# EAGLE design b10n1c (EAGLE 6.4)
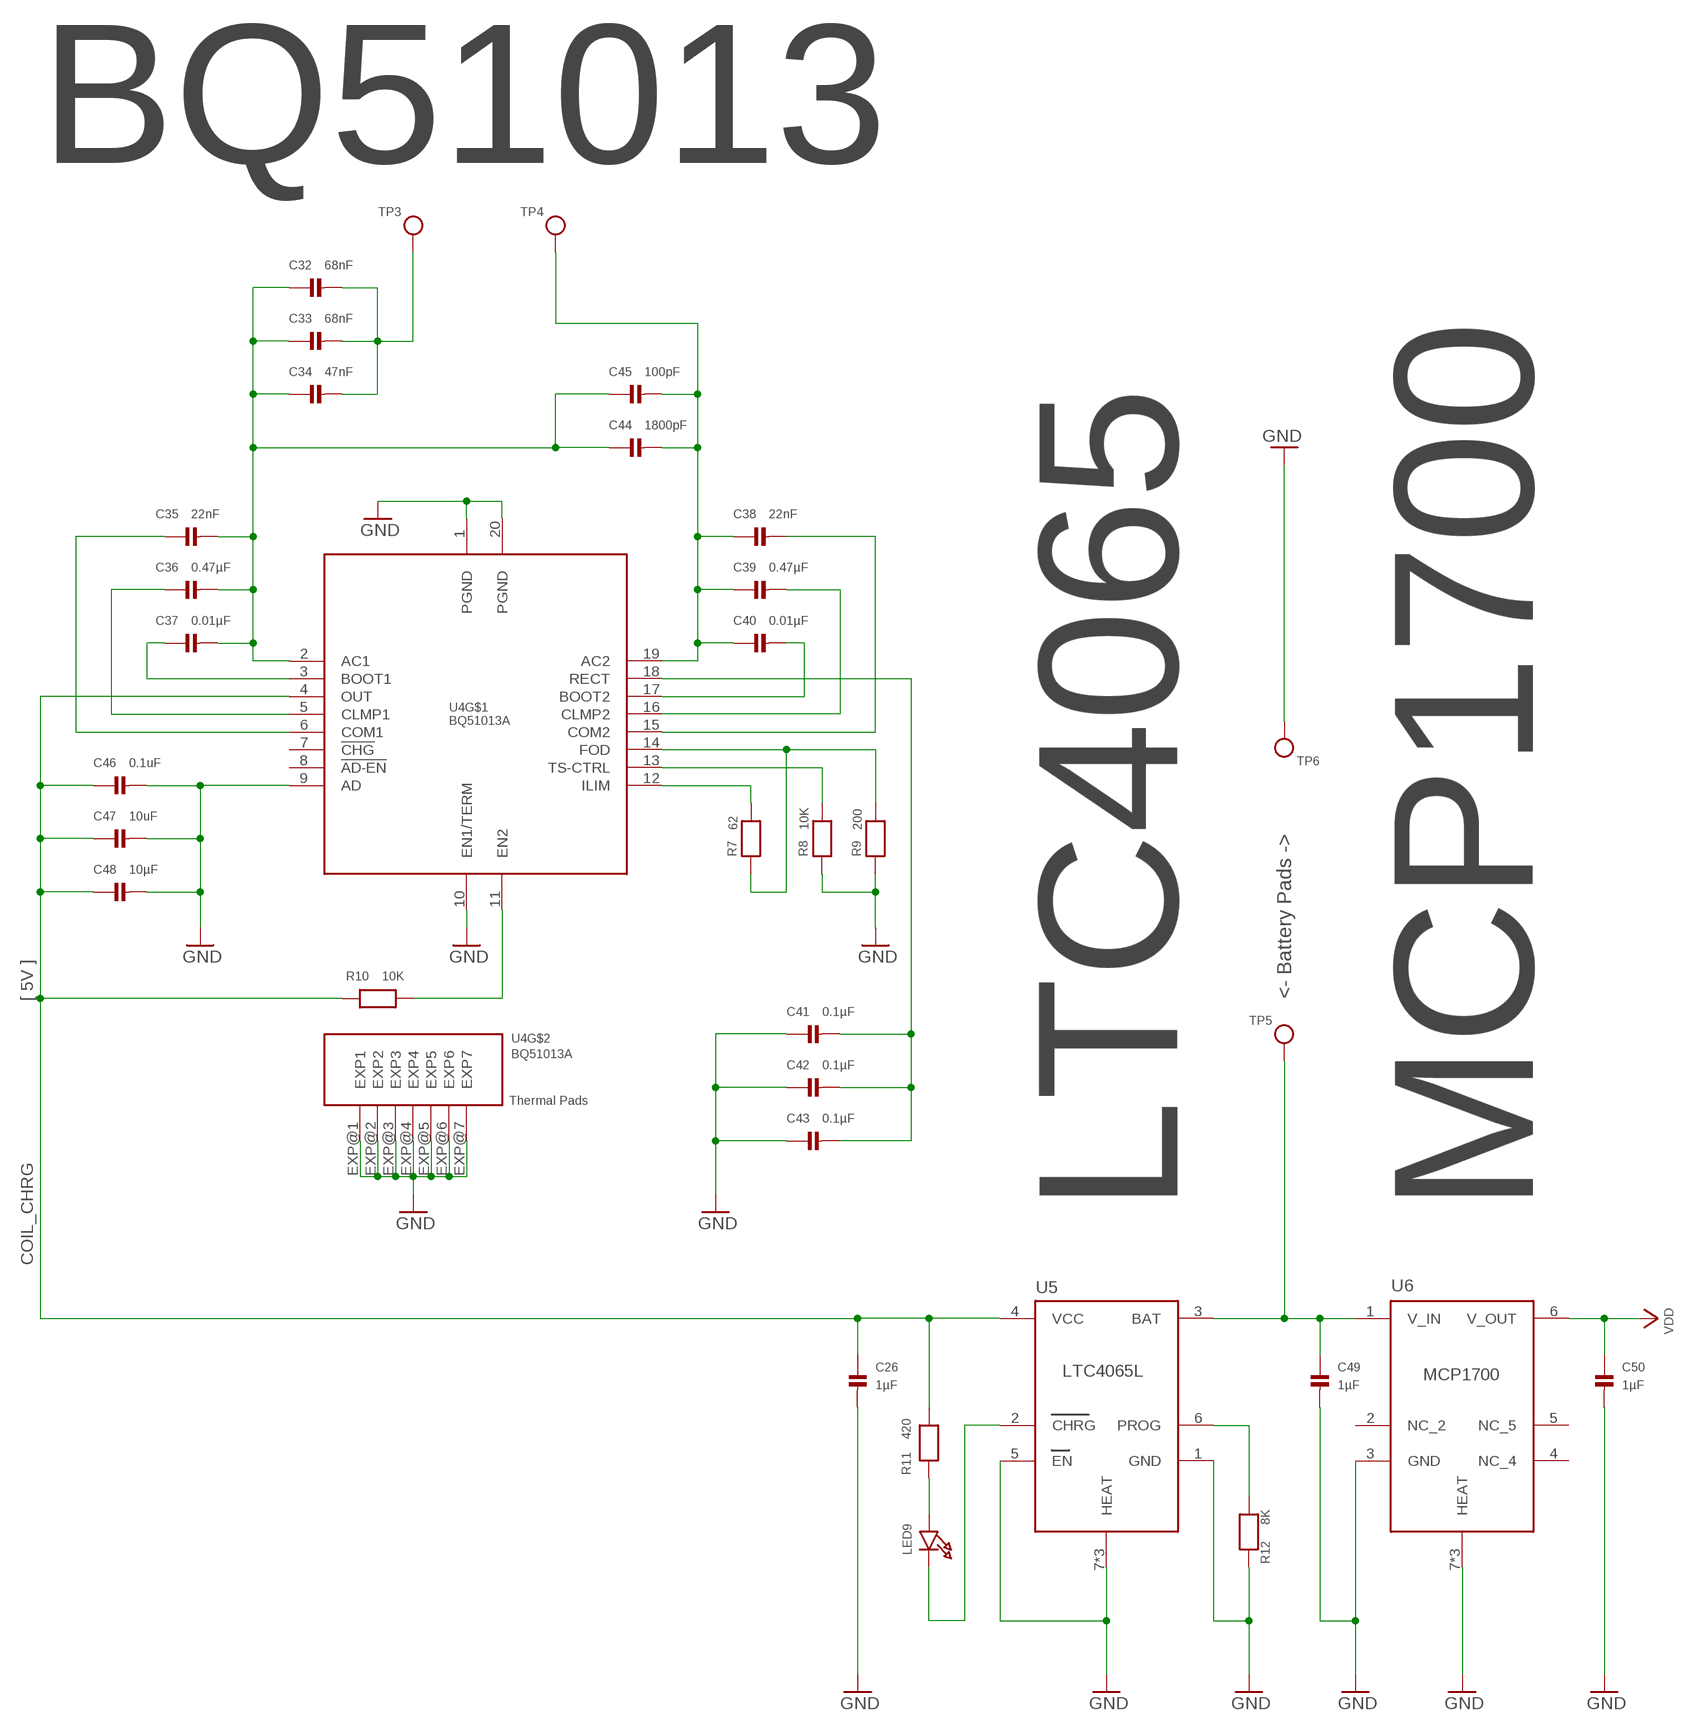
[diagram p0: schematic, sheet 1, part 1 of 2]
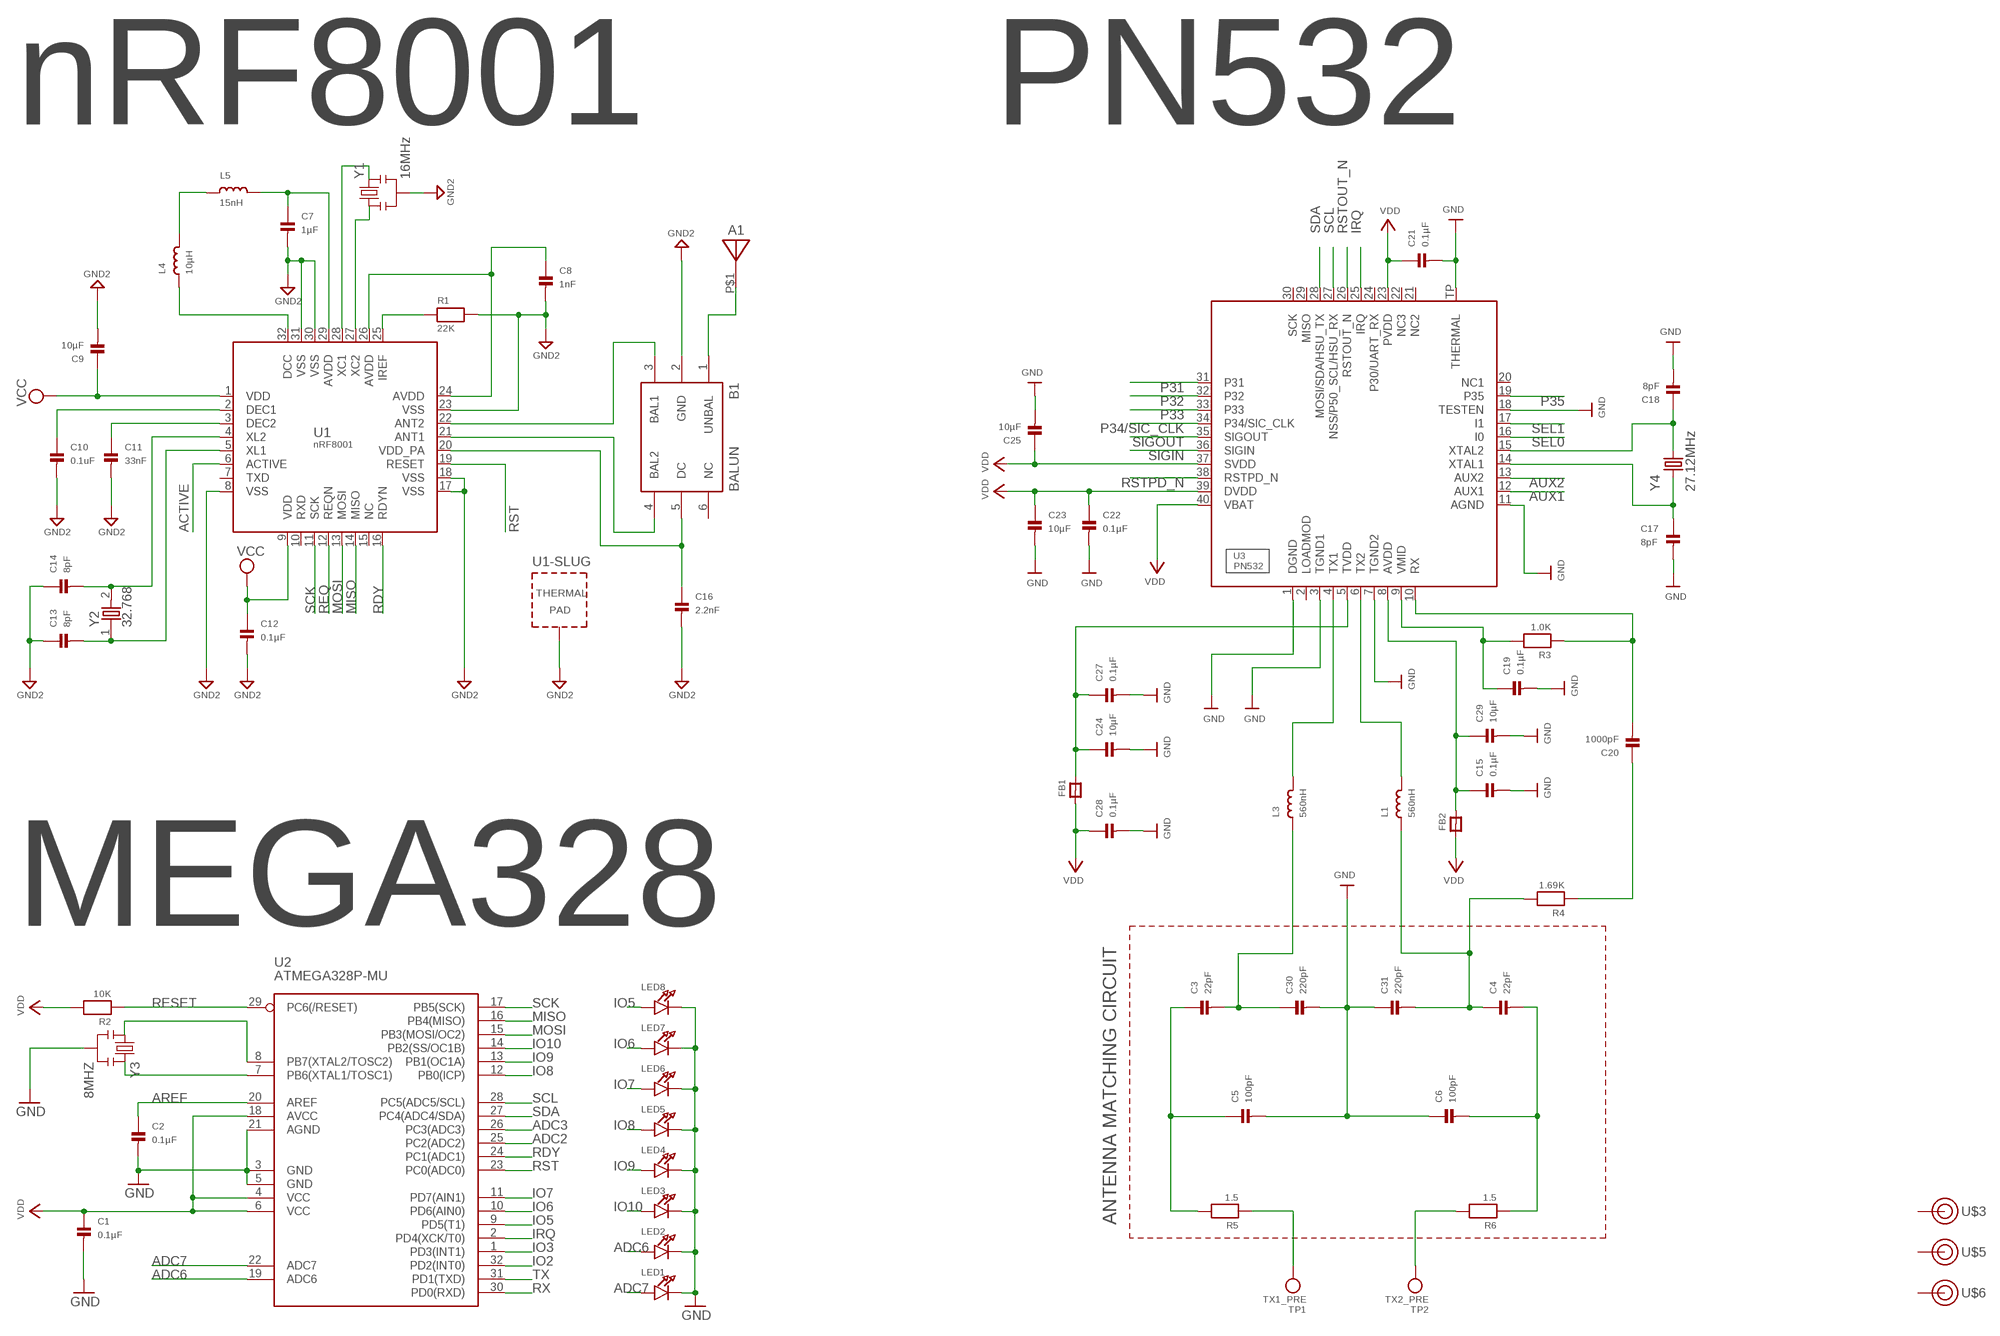
[diagram p1: schematic, sheet 1, part 2 of 2]

## Parts
A1  2450AT18A100  [2450AT18A100]
B1  2450BM14A0002T  [2450BM14A0002T]
C1  0.1µF  CAP_CERAMIC_0402MP  [_0402MP]
C2  0.1µF  CAP_CERAMIC_0402MP  [_0402MP]
C3  22pF  CAP_CERAMIC_0402MP  [_0402MP]
C4  22pF  CAP_CERAMIC_0402MP  [_0402MP]
C5  100pF  CAP_CERAMIC_0402MP  [_0402MP]
C6  100pF  CAP_CERAMIC_0402MP  [_0402MP]
C7  1µF  CAP_CERAMIC_0402MP  [_0402MP]
C8  1nF  CAP_CERAMIC_0402MP  [_0402MP]
C9  10µF  CAP_CERAMIC_0402MP  [_0402MP]
C10  0.1uF  CAP_CERAMIC_0402MP  [_0402MP]
C11  33nF  CAP_CERAMIC_0402MP  [_0402MP]
C12  0.1µF  CAP_CERAMIC_0402MP  [_0402MP]
C13  8pF  CAP_CERAMIC_0402MP  [_0402MP]
C14  8pF  CAP_CERAMIC_0402MP  [_0402MP]
C15  0.1µF  CAP_CERAMIC_0402MP  [_0402MP]
C16  2.2nF  CAP_CERAMIC_0402MP  [_0402MP]
C17  8pF  CAP_CERAMIC_0402MP  [_0402MP]
C18  8pF  CAP_CERAMIC_0402MP  [_0402MP]
C19  0.1µF  CAP_CERAMIC_0402MP  [_0402MP]
C20  1000pF  CAP_CERAMIC_0402MP  [_0402MP]
C21  0.1µF  CAP_CERAMIC_0402MP  [_0402MP]
C22  0.1µF  CAP_CERAMIC_0402MP  [_0402MP]
C23  10µF  CAP_CERAMIC_0402MP  [_0402MP]
C24  10µF  CAP_CERAMIC_0402MP  [_0402MP]
C25  10µF  CAP_CERAMIC_0402MP  [_0402MP]
C26  1µF  CAP_CERAMIC_0402MP  [_0402MP]
C27  0.1µF  CAP_CERAMIC_0402MP  [_0402MP]
C28  0.1µF  CAP_CERAMIC_0402MP  [_0402MP]
C29  10µF  CAP_CERAMIC_0402MP  [_0402MP]
C30  220pF  CAP_CERAMIC_0402MP  [_0402MP]
C31  220pF  CAP_CERAMIC_0402MP  [_0402MP]
C32  68nF  CAP_CERAMIC_0402MP  [_0402MP]
C33  68nF  CAP_CERAMIC_0402MP  [_0402MP]
C34  47nF  CAP_CERAMIC_0402MP  [_0402MP]
C35  22nF  CAP_CERAMIC_0402MP  [_0402MP]
C36  0.47µF  CAP_CERAMIC_0402MP  [_0402MP]
C37  0.01µF  CAP_CERAMIC_0402MP  [_0402MP]
C38  22nF  CAP_CERAMIC_0402MP  [_0402MP]
C39  0.47µF  CAP_CERAMIC_0402MP  [_0402MP]
C40  0.01µF  CAP_CERAMIC_0402MP  [_0402MP]
C41  0.1µF  CAP_CERAMIC_0402MP  [_0402MP]
C42  0.1µF  CAP_CERAMIC_0402MP  [_0402MP]
C43  0.1µF  CAP_CERAMIC_0402MP  [_0402MP]
C44  1800pF  CAP_CERAMIC_0402MP  [_0402MP]
C45  100pF  CAP_CERAMIC_0402MP  [_0402MP]
C46  0.1uF  CAP_CERAMIC_0402MP  [_0402MP]
C47  10uF  CAP_CERAMIC_0402MP  [_0402MP]
C48  10µF  CAP_CERAMIC_0402MP  [_0402MP]
C49  1µF  CAP_CERAMIC_0402MP  [_0402MP]
C50  1µF  CAP_CERAMIC_0402MP  [_0402MP]
FB1  FERRITE_0402MP  [_0402MP]
FB2  FERRITE_0402MP  [_0402MP]
L1  560nH  INDUCTOR_0402MP  [_0402MP]
L3  560nH  INDUCTOR_0402MP  [_0402MP]
L4  10µH  INDUCTOR_0603MP  [_0603MP]
L5  15nH  INDUCTOR_0402MP  [_0402MP]
LED1  LED0603_NOOUTLINE  [CHIPLED_0603_NOOUTLINE]
LED2  LED0603_NOOUTLINE  [CHIPLED_0603_NOOUTLINE]
LED3  LED0603_NOOUTLINE  [CHIPLED_0603_NOOUTLINE]
LED4  LED0603_NOOUTLINE  [CHIPLED_0603_NOOUTLINE]
LED5  LED0603_NOOUTLINE  [CHIPLED_0603_NOOUTLINE]
LED6  LED0603_NOOUTLINE  [CHIPLED_0603_NOOUTLINE]
LED7  LED0603_NOOUTLINE  [CHIPLED_0603_NOOUTLINE]
LED8  LED0603_NOOUTLINE  [CHIPLED_0603_NOOUTLINE]
LED9  LED0603_NOOUTLINE  [CHIPLED_0603_NOOUTLINE]
R1  22K  RESISTOR_0402MP  [_0402MP]
R2  10K  RESISTOR_0402MP  [_0402MP]
R3  1.0K  RESISTOR_0402MP  [_0402MP]
R4  1.69K  RESISTOR_0402MP  [_0402MP]
R5  1.5  RESISTOR_0402MP  [_0402MP]
R6  1.5  RESISTOR_0402MP  [_0402MP]
R7  62  RESISTOR_0402MP  [_0402MP]
R8  10K  RESISTOR_0402MP  [_0402MP]
R9  200  RESISTOR_0402MP  [_0402MP]
R10  10K  RESISTOR_0402MP  [_0402MP]
R11  420  RESISTOR_0402MP  [_0402MP]
R12  8K  RESISTOR_0402MP  [_0402MP]
TP1  TX1_PRE  TESTPOINTROUND1MM  [TESTPOINT_ROUND_1MM]
TP2  TX2_PRE  TESTPOINTROUND1MM  [TESTPOINT_ROUND_1MM]
TP3  TESTPOINTROUND1MM  [TESTPOINT_ROUND_1MM]
TP4  TESTPOINTROUND1MM  [TESTPOINT_ROUND_1MM]
TP5  TESTPOINTROUND1MM  [TESTPOINT_ROUND_1MM]
TP6  TESTPOINTROUND1MM  [TESTPOINT_ROUND_1MM]
U1  nRF8001  NRF8001  [QFN32_5MM]
U2  ATMEGA328P-MU  ATMEGAXX8-MU  [MLF32-M1-A]
U3  PN532  [HVQFN40-6X6]
U4  BQ51013A  [RHL_R-VQFN-N20]
U5  LTC4065L  [LTC4065L]
U6  MCP1700  [MCP1700]
U$3  MAKE-UB312-MICRO  [MAKE-UB312-MICRO]
U$5  MAKE-UB312-MICRO  [MAKE-UB312-MICRO]
U$6  MAKE-UB312-MICRO  [MAKE-UB312-MICRO]
Y1  16MHz  RESONATOR16MHZ  [RESONATOR-SMD]
Y2  32.768  CRYSTAL2PIN  [CRYSTAL-2PIN]
Y3  8MHZ  RESONATOR8MHZ  [RESONATOR-SMD]
Y4  27.12MHz  CRYSTAL  [CRYSTAL-MURATA-XRCGB27M120F3M00R0]

## Nets
AC: B1.2(GND) C7.2 C8.2 C9.2 C10.2 C11.2 C12.2 C13.1 C14.1 C16.2 R1.2 U1.8(VSS) U1.17(VSS) U1.18(VSS) U1.23(VSS) U1.30(VSS) U1.31(VSS) U1.33(TP) Y1.2 ; supply symbol labelled GND2
AC1: C32.2 C33.2 C34.2 TP3.P$1
AC2: C38.1 C39.1 C40.1 C44.2 C45.2 TP4.P$1 U4.19(AC2)
ACTIVE: U1.6(ACTIVE)
ADC2: U2.25(PC2(ADC2))
ADC3: U2.26(PC3(ADC3))
ADC6: LED2.A U2.19(ADC6)
ADC7: LED1.A U2.22(ADC7)
AREF: C2.1 U2.20(AREF)
AUX1: U3.12(AUX1)
AUX2: U3.13(AUX2)
COIL_CHRG: C26.1 C46.1 C47.1 C48.1 R10.2 R11.1 U4.4(OUT) U5.4(VCC)
GND: C1.2 C2.2 C5.2 C6.1 C15.2 C17.2 C18.2 C19.2 C21.2 C22.2 C23.2 C24.2 C25.2 C26.2 C27.2 C28.2 C29.2 C30.2 C31.1 C41.1 C42.1 C43.1 C46.2 C47.2 C48.2 C49.2 C50.2 LED1.C LED2.C LED3.C LED4.C LED5.C LED6.C LED7.C LED8.C R8.1 R9.1 R12.2 TP6.P$1 U2.3(GND) U2.5(GND) U2.21(AGND) U3.1(DGND) U3.3(TGND1) U3.7(TGND2) U3.11(AGND) U3.18(TESTEN) U3.TP(THERMAL) U4.1(PGND) U4.9(AD) U4.10(EN1/TERM) U4.20(PGND) U4.EXP@1(EXP1) U4.EXP@2(EXP2) U4.EXP@3(EXP3) U4.EXP@4(EXP4) U4.EXP@5(EXP5) U4.EXP@6(EXP6) U4.EXP@7(EXP7) U5.1(GND) U5.5(EN) U5.7(HEAT) U5.71(HEAT) U5.72(HEAT) U6.3(GND) U6.7(HEAT) U6.71(HEAT) U6.72(HEAT) Y3.2
IO2: U2.32(PD2(INT0))
IO3: U2.1(PD3(INT1))
IO5: LED8.A U2.9(PD5(T1))
IO6: LED7.A U2.10(PD6(AIN0))
IO7: LED6.A U2.11(PD7(AIN1))
IO8: LED5.A U2.12(PB0(ICP))
IO9: LED4.A U2.13(PB1(OC1A))
IO10: LED3.A U2.14(PB2(SS/OC1B))
IRQ: U2.2(PD4(XCK/T0)) U3.25(IRQ)
MISO: U1.14(MISO) U2.16(PB4(MISO))
MOSI: U1.13(MOSI) U2.15(PB3(MOSI/OC2))
N$1: B1.5(DC) C16.1 U1.20(VDD_PA)
N$2: C7.1 L5.2 U1.29(AVDD)
N$3: C8.1 U1.24(AVDD) U1.26(AVDD)
N$4: U2.7(PB6(XTAL1/TOSC1)) Y3.3
N$5: L4.2 L5.1
N$6: U2.8(PB7(XTAL2/TOSC2)) Y3.1
N$7: C11.1 U1.3(DEC2)
N$8: C10.1 U1.2(DEC1)
N$9: U1.28(XC1) Y1.3
N$10: U1.27(XC2) Y1.1
N$11: L4.1 U1.32(DCC)
N$12: R1.1 U1.25(IREF)
N$13: L3.2 U3.4(TX1)
N$14: B1.4(BAL2) U1.21(ANT1)
N$15: B1.3(BAL1) U1.22(ANT2)
N$16: A1.P$1 B1.1(UNBAL)
N$17: L1.2 U3.6(TX2)
N$18: C3.2 C30.1 L3.1
N$19: C17.1 U3.14(XTAL1) Y4.1
N$20: C18.1 U3.15(XTAL2) Y4.3
N$21: C19.1 R3.2 U3.9(VMID)
N$22: C14.2 U1.4(XL2) Y2.2
N$23: C13.2 U1.5(XL1) Y2.1
N$24: C20.2 R3.1 U3.10(RX)
N$25: C20.1 R4.1
N$26: C4.1 C31.2 L1.1 R4.2
N$27: R5.1 TP1.P$1
N$28: R6.2 TP2.P$1
N$29: C15.1 C29.1 FB2.2 U3.8(AVDD)
N$30: C24.1 C27.1 FB1.2 U3.5(TVDD)
N$31: C32.1 C33.1 C34.1 C35.2 C36.2 C37.2 C44.1 C45.1 U4.2(AC1)
N$32: LED9.A R11.2
N$33: C40.2 U4.17(BOOT2)
N$34: C41.2 C42.2 C43.2 U4.18(RECT)
N$35: C37.1 U4.3(BOOT1)
N$36: C36.1 U4.5(CLMP1)
N$37: C35.1 U4.6(COM1)
N$38: C39.2 U4.16(CLMP2)
N$39: C38.2 U4.15(COM2)
N$40: R7.1 R9.2 U4.14(FOD)
N$41: R8.2 U4.13(TS-CTRL)
N$42: R10.1 U4.11(EN2)
N$43: R7.2 U4.12(ILIM)
N$44: LED9.C U5.2(CHRG)
N$45: R12.1 U5.6(PROG)
N$47: C49.1 TP5.P$1 U5.3(BAT) U6.1(V_IN)
P31: U3.31
P32: U3.32
P33: U3.33
P34/SIC_CLK: U3.34(P34/SIC_CLK)
P35: U3.19(P35)
RDY: U1.16(RDYN) U2.24(PC1(ADC1))
REQ: U1.12(REQN)
RESET: R2.1 U2.29(PC6(/RESET))
RST: U1.19(RESET) U2.23(PC0(ADC0))
RSTOUT_N: U3.26(RSTOUT_N)
RSTPD_N: U3.38(RSTPD_N)
RX: U2.30(PD0(RXD))
SCK: U1.11(SCK) U2.17(PB5(SCK))
SCL: U2.28(PC5(ADC5/SCL)) U3.27(NSS/P50_SCL/HSU_RX)
SDA: U2.27(PC4(ADC4/SDA)) U3.28(MOSI/SDA/HSU_TX)
SEL0: U3.16(I0)
SEL1: U3.17(I1)
SIGIN: U3.36(SIGIN)
SIGOUT: U3.35(SIGOUT)
TX: U2.31(PD1(TXD))
TX1_ANTENNA: C3.1 C5.1 R5.2
TX2_ANTENNA: C4.2 C6.2 R6.1
VCC: C9.1 C12.1 U1.1(VDD) U1.9(VDD)
VDD: C1.1 C21.1 C22.1 C23.1 C25.1 C28.1 C50.1 FB1.1 FB2.1 R2.2 U2.4(VCC) U2.6(VCC) U2.18(AVCC) U3.23(PVDD) U3.37(SVDD) U3.39(DVDD) U3.40(VBAT) U6.6(V_OUT)
Unconnected: B1.6(NC) U1.7(TXD) U1.10(RXD) U1.15(NC) U3.2(LOADMOD) U3.20(NC1) U3.21(NC2) U3.22(NC3) U3.24(P30/UART_RX) U3.29(MISO) U3.30(SCK) U4.7(!CHG) U4.8(!AD-EN) U6.2(NC_2) U6.4(NC_4) U6.5(NC_5) U$3.P$1(T) U$5.P$1(T) U$6.P$1(T)

## Notes on the sheet
- BQ51013 | nRF8001 | PN532
- BALUN
- [ 5V ] | <- Battery Pads ->
- Thermal Pads
- LTC4065 | MCP1700 | MEGA328
- ANTENNA MATCHING CIRCUIT

## Library data of the parts
A1 = Johanson_antenna:2450AT18A100
B1 = Johanson_balun:2450BM14A0002T: 2.45 GHz Impedance Matched Balun-Filter: Optimized for Nordic's Chipset nRF24L01, nRF24L01+, nRF24LE1, nRF24LU1, nRF24AP2, and nRF8001 Datasheet via Farnell , take into account the 2.2NF cap; FARNELL_OC: 2148533; FREQUENCY: 2400-2500mhz; UNBALIMPEDANCE: 50 ohm
C1-C12 C15-C50 = microbuilder:CAP_CERAMIC: Ceramic Capacitors 0402 - 0402 Surface Mount Capacitors 16pF 50V 5% [Digikey: 445-4899-2-ND] 18pF 50V 5% [Digikey: 490-1281-2-ND] 22pF 50V 5% [Digikey: 490-1283-2-ND] 68pF 50V 5% [Digikey: 490-1289-2-ND] 0.1uF 10V 10% [Digikey: 490-1318-2-ND] 1.0uF 6.3V 10% [Digikey: 490-1320-2-ND] 0603 - 0603 Surface Mount Capacitors 16 pF 50V 5% [Digikey: 445-5051-2-ND] 22 pF 50V [Digikey: PCC220ACVTR-ND] 33 pF 50V 5% [Digikey: 490-1415-1-ND] 56pF 50V 5% [Digikey: 490-1421-1-ND] 220pF 50V 5% [Digikey: 445-1285-1-ND] 680 pF 50V 2200 pF 50V 5% C0G [Digikey: 445-1297-1-ND] 5600 pF 100V 5% X7R [Digikey: 478-3711-1-ND] 0.1 µF 25V 10% [Digikey: PCC2277TR-ND] 0.22 µF 16V 10% X7R [Digikey: 445-1318-1-ND] 1.0 µF 25V 10% [Digikey: 445-5146-2-ND] 0603 - RF Specific 3pF 250V +/-0.1pF RF [Digikey: 712-1347-1-ND] 18 pF 250V 5% [Digikey: 478-3505-1-ND or 712-1322-1-ND] 56 pF 250V 5% C0G RF [Digikey: 490-4867-1-ND] 68 pF 250V RF [Digikey: 490-4868-1-ND] 0805 - 0805 Surface Mount Capacitors 220 pF 250V 2% RF Ceramic Capacitor [Digikey: 712-1398-1-ND] 1000 pF 50V 2% NP0 Ceramic Capacitor [Digikey: 478-3760-1-ND] 0.1 µF 25V 10% Ceramic Capacitor [Digikey: PCC1828TR-ND] 1.0 µF 16V 10% Ceramic Capacitor[Digikey: 490-1691-2-ND] 10.0 µF 10V 10% Ceramic Capacitor[Digikey: 709-1228-1-ND] 10.0 uF 16V 10% Ceramic Capacitor [Digikey: 478-5165-2-ND] 47 uF 6.3V 20% Ceramic Capacitor [Digikey: 587-1779-1-ND or 399-5506-1-ND] 1206 - 1206 Surface Mount Capacitors 47uF 10V 20% Ceramic Capacitor [Digikey: 490-5528-1-ND or 399-5508-1-ND or 445-6010-1-ND] 100uF 6.3V -20%, +80% Y5V Ceramic Capacitor (Digikey: 490-4512-1-ND, Mouser: 81-GRM31CF50J107ZE1L)
C13 C14 = microbuilder:CAP_CERAMIC: Ceramic Capacitors 0402 - 0402 Surface Mount Capacitors 16pF 50V 5% [Digikey: 445-4899-2-ND] 18pF 50V 5% [Digikey: 490-1281-2-ND] 22pF 50V 5% [Digikey: 490-1283-2-ND] 68pF 50V 5% [Digikey: 490-1289-2-ND] 0.1uF 10V 10% [Digikey: 490-1318-2-ND] 1.0uF 6.3V 10% [Digikey: 490-1320-2-ND] 0603 - 0603 Surface Mount Capacitors 16 pF 50V 5% [Digikey: 445-5051-2-ND] 22 pF 50V [Digikey: PCC220ACVTR-ND] 33 pF 50V 5% [Digikey: 490-1415-1-ND] 56pF 50V 5% [Digikey: 490-1421-1-ND] 220pF 50V 5% [Digikey: 445-1285-1-ND] 680 pF 50V 2200 pF 50V 5% C0G [Digikey: 445-1297-1-ND] 5600 pF 100V 5% X7R [Digikey: 478-3711-1-ND] 0.1 µF 25V 10% [Digikey: PCC2277TR-ND] 0.22 µF 16V 10% X7R [Digikey: 445-1318-1-ND] 1.0 µF 25V 10% [Digikey: 445-5146-2-ND] 0603 - RF Specific 3pF 250V +/-0.1pF RF [Digikey: 712-1347-1-ND] 18 pF 250V 5% [Digikey: 478-3505-1-ND or 712-1322-1-ND] 56 pF 250V 5% C0G RF [Digikey: 490-4867-1-ND] 68 pF 250V RF [Digikey: 490-4868-1-ND] 0805 - 0805 Surface Mount Capacitors 220 pF 250V 2% RF Ceramic Capacitor [Digikey: 712-1398-1-ND] 1000 pF 50V 2% NP0 Ceramic Capacitor [Digikey: 478-3760-1-ND] 0.1 µF 25V 10% Ceramic Capacitor [Digikey: PCC1828TR-ND] 1.0 µF 16V 10% Ceramic Capacitor[Digikey: 490-1691-2-ND] 10.0 µF 10V 10% Ceramic Capacitor[Digikey: 709-1228-1-ND] 10.0 uF 16V 10% Ceramic Capacitor [Digikey: 478-5165-2-ND] 47 uF 6.3V 20% Ceramic Capacitor [Digikey: 587-1779-1-ND or 399-5506-1-ND] 1206 - 1206 Surface Mount Capacitors 47uF 10V 20% Ceramic Capacitor [Digikey: 490-5528-1-ND or 399-5508-1-ND or 445-6010-1-ND] 100uF 6.3V -20%, +80% Y5V Ceramic Capacitor (Digikey: 490-4512-1-ND, Mouser: 81-GRM31CF50J107ZE1L); DIGIKEY: 490-5880-1-ND
FB1 FB2 = microbuilder:FERRITE: Ferrite Bead 0603 MMZ1608B121C - 120 Ohm @ 100MHz, 600mA, 0.15 Ohm DC Resistance - Digikey: 445-2164-1-ND BK1608HW121-T - 120 Ohm, 600mA Ferrite Chip - Digikey: 587-1876-2-ND 0805 HZ0805B272R-10 - 2.7K Ohm @ 100MHz, 200mA, 0.8 Ohm DC Resistance - Digikey: 240-2504-1-ND (see also Murata BLM21BD272SN1L) MMZ2012Y152B - 1.5K Ohm @ 100MHz, 500mA, 0.4 Ohm DC Resistance - Digikey: 445-1560-1-ND - Mainly for high frequency (80-400MHz) MMZ2012R102A - 1K Ohm @ 100MHz, 500mA, 0.3 Ohm DC Resistance - Digikey: 445-1555-2-ND - More general purpose (10-200MHz)
L1 L3 L4 = microbuilder:INDUCTOR: Inductors 0603: 10nH Ceramic Inductor - microwire antenna/RF (Digikey: 712-1434-2-ND) 0805: 560nH Ceramic Inductor - RF (Digikey: 553-1047-1-ND) 270nH Ceramic Inductor - Q = 40@250MHz, +-5%, 1 Ohm DC Resistance (Digikey: 535-10506-2-ND) 1007 (2518 Metric) SMT: 10µH 10% 250mOhm 820mA 1007 Inductor (Digikey: 587-2189-1-ND) 22µH 10% 500mOhm 580mA 1007 Inductor (Digikey: 587-2190-1-ND) 47µH 10% 950mOhm 420mA 1007 Inductor (Digikey: 587-2191-1-ND) 47µH 5% 100mOhm 1A 1008 Inductor (Digikey: 732-1816-1-ND) 5.0x5.0mm (Taiyo Yuden NR5040 Series) 6.8µH 20% 2.3A 64mOhm Inductor (Digikey: 587-2374-2-ND) 5.0x5.0mm (TDK VLC5045 Series) 4.7µH 20% 3.3A 34mOhm Inductor (Digikey: 445-6526-1-ND) 6.8µH 20% 2.7A 46mOhm Inductor (Digikey: 445-6527-1-ND) 6.0x6.0mm (TDK VLC6045 Series) 4.7µH 20% 3.8A 27mOhm Inductor (Digikey: 445-6538-2-ND) 6.8µH 20% 3A 41mOhm Inductor (Digikey: 445-6540-1-ND) 6.2µH 30% 2.2A 45mOhm Inductor (Digikey: SRR5028-6R2YCT-ND) - Not TDK VLC6045 but footprint should match 6.0x6.0mm (TDK SLF6045 Series) 6.8uH 30% 2A 33mOhm Inductor (Digikey: 445-4572-1-ND, Mouser: 810-SLF645T6R8N2R0PF)
L5 = microbuilder:INDUCTOR: Inductors 0603: 10nH Ceramic Inductor - microwire antenna/RF (Digikey: 712-1434-2-ND) 0805: 560nH Ceramic Inductor - RF (Digikey: 553-1047-1-ND) 270nH Ceramic Inductor - Q = 40@250MHz, +-5%, 1 Ohm DC Resistance (Digikey: 535-10506-2-ND) 1007 (2518 Metric) SMT: 10µH 10% 250mOhm 820mA 1007 Inductor (Digikey: 587-2189-1-ND) 22µH 10% 500mOhm 580mA 1007 Inductor (Digikey: 587-2190-1-ND) 47µH 10% 950mOhm 420mA 1007 Inductor (Digikey: 587-2191-1-ND) 47µH 5% 100mOhm 1A 1008 Inductor (Digikey: 732-1816-1-ND) 5.0x5.0mm (Taiyo Yuden NR5040 Series) 6.8µH 20% 2.3A 64mOhm Inductor (Digikey: 587-2374-2-ND) 5.0x5.0mm (TDK VLC5045 Series) 4.7µH 20% 3.3A 34mOhm Inductor (Digikey: 445-6526-1-ND) 6.8µH 20% 2.7A 46mOhm Inductor (Digikey: 445-6527-1-ND) 6.0x6.0mm (TDK VLC6045 Series) 4.7µH 20% 3.8A 27mOhm Inductor (Digikey: 445-6538-2-ND) 6.8µH 20% 3A 41mOhm Inductor (Digikey: 445-6540-1-ND) 6.2µH 30% 2.2A 45mOhm Inductor (Digikey: SRR5028-6R2YCT-ND) - Not TDK VLC6045 but footprint should match 6.0x6.0mm (TDK SLF6045 Series) 6.8uH 30% 2A 33mOhm Inductor (Digikey: 445-4572-1-ND, Mouser: 810-SLF645T6R8N2R0PF); DIGIKEY: 712-1408-1-ND
LED1-LED9 = microbuilder:LED: LED 0603 - 0603 Surface Mount Package 2mA: Green LED - Low Power (3.9mcd, 2ma, 1.7Vf) - Digikey: 475-2709-2-ND Orange LED - Low Power (9.8mcd, 2ma, 1.8Vf) - Digikey: 475-1194-2-ND Red LED - Low Power (5mcd, 2ma, 1.8Vf) - Digikey: 475-1195-2-ND Yellow LED - Low Power (7mcd, 2ma, 1.8Vf) - Digikey: 475-1196-2-ND 5mA: Blue LED - Low Power (17mcd, 5ma, 2.9Vf) - Digikey: LNJ937W8CRACT-ND 0805 - 0805 Surface Mount Package 2mA: Red LED (8.8mcd, 2mA, 1.8Vf, Clear) - Low Power [Digikey: 475-2510-1-ND] Green LED (5mcd, 2mA, 1.8Vf, Clear) - Low Power [Digikey: 475-2730-1-ND] Yellow LED (11.3mcd, 2mA, 1.8Vf, Clear) - Low Power [Digikey: 475-2555-1-ND] 20mA: Red LED (104mcd, 20mA, Diffused) - LS R976 [Digikey: 475-1278-6-ND] Red LED (12mcd, 20mA, 2.0Vf, Clear) - APT2012EC [Digikey: 754-1128-1-ND] Green LED (15mcd, 20mA, 2.2Vf, Clear) - APT2012GC [Digikey: 754-1131-1-ND] Orange LED (160mcd, 20mA, 2.1Vf, Clear) - APT2012SECK [Digikey: 754-1130-1-ND] 1206 - 1206 Surface Mount Package Green LED (26mcd, 20mA, Diffused) - LG N971 [Digikey: 475-1407-6-ND] Red LED (15mcd, 20mA, Diffused) - LH N974 [Digikey: 475-1416-6-ND]
R1-R12 = microbuilder:RESISTOR: Resistors 0402 - 0402 Surface Mount Package 22 Ohm 1% 1/16W [Digikey: 311-22.0LRTR-ND] 33 Ohm 5% 1/16W 1.0K 5% 1/16W 1.5K 5% 1/16W 2.0K 1% 1/16W 10.0K 1% 1/16W [Digikey: 311-10.0KLRTR-ND] 10.0K 5% 1/16W [Digikey: RMCF0402JT10K0TR-ND] 12.1K 1% 1/16W [Digikey: 311-22.0LRTR-ND] 100.0K 5% 1/16W 0603 - 0603 Surface Mount Package 0 Ohm 1/10 Watt 1% Resistor 15 Ohm 1/10 Watt 1% Resistor 33 Ohm 1/10 Watt 1% Resistor 49.9 Ohm 1/10 Watt 1% Resistor 100 Ohm 1/10 Watt 1% Resistor 150 Ohm 1/10 Watt 1% Resistor 240 Ohm 1/10 Watt 1% Resistor 390 Ohm 1/10 Watt 1% Resistor 560 Ohm 1/10 Watt 1% Resistor 680 Ohm 1/10 Watt 1% Resistor 750 Ohm 1/10 Watt 1% Resistor 1.0K Ohm 1/10 Watt 1% Resistor 1.5K Ohm 1/10 Watt 1% Resistor 2.0K Ohm 1/10 Watt 1% Resistor 2.2K Ohm 1/10 Watt 1% Resistor 3.3K Ohm 1/10 Watt 1% Resistor 4.7K Ohm 1/10 Watt 1% Resistor 10.0K Ohm 1/10 Watt 1% Resistor 12.0K Ohm 1/10 Watt 1% Resistor 12.1K Ohm 1/10 Watt 1% Resistor 20.0K Ohm 1/10 Watt 1% Resistor 33.0K Ohm 1/10 Watt 1% Resistor 100.0K Ohm 1/10 Watt 1% Resistor 0805 - 0805 Surface Mount Package 0 Ohm 1/8 Watt 1% Resistor 33 Ohm 1/8 Watt 1% Resistor 100 Ohm 1/8 Watt 1% Resistor 150 Ohm 1/8 Watt 1% Resistor 200 Ohm 1/8 Watt 1% Resistor 240 Ohm 1/8 Watt 1% Resistor 330 Ohm 1/8 Watt 1% Resistor 390 Ohm 1/8 Watt 1% Resistor 470 Ohm 1/8 Watt 1% Resistor 1.0K Ohm 1/8 Watt 1% Resistor 1.5K Ohm 1/8 Watt 1% Resistor 2.0K Ohm 1/8 Watt 1% Resistor 4.7K Ohm 1/8 Watt 1% Resistor 5.1K Ohm 1/8 Watt 1% Resistor 5.6K Ohm 1/8 Watt 1% Resistor 10.0K Ohm 1/8 Watt 1% Resistor 22.0K Ohm 1/8 Watt 1% Resistor 33.0K Ohm 1/8 Watt 1% Resistor 100K Ohm 1/8 Watt 1% Resistor 1206 - 1206 Surface Mount Package 2012 - 2010 Surface Mount Package 0.11 Ohm 1/2 Watt 1% Resistor - Digikey: RHM.11UCT-ND
TP1-TP6 = microbuilder:TESTPOINT: Test Point Various test points for characterisation and PCB testing TESTPOINT_SMT - Compact Surface Mount Test Point [Digikey: 5016KTR-ND]
U1 = microbuilder:NRF8001: nRF8001 - Bluetooth Low-Energy Transceiver VDD: 1.9-3.6V Temp: -40°C - 85°C
U2 = Smartprj:ATMEGAXX8: MICROCONTROLLER 8 Kbytes FLASH 1 kbytes SRAM 512 bytes EEPROM USART 6-channel 10 bit ADC 2-channel 8 bit ADC Source: avr.lbr
U3 = microbuilder:PN532: PN532 - Near Field Communication (NFC) controller Highly integrated transceiver module for contactless communication at 13.56 MHz (14443A/MIFARE, FeliCa, I4443B)
U4 = bq500211_bq500210_bq51013a:BQ51013A: Integrated Wireless Power Supply Receiver, Qi Compliant
U5 = LTC4065L:LTC4065L
U6 = MCP1700:MCP1700
U$3 U$5 U$6 = pads-for-MAKE-UB312-micro:MAKE-UB312-MICRO: This 16g Stainless Steel Barbell is great for micro piercings in tight places. The gauge is 16g (1.2mm) and you can choose the length. You have a choice of the ball size and the threading is external. If you're looking for a short or long, thin barbell, this is the straight barbell for you. http://store.painfulpleasures.com/16g-micro-straight-steel-barbell.html
Y1 = SparkFun-FreqCtrl:RESONATOR: Resonator Small SMD resonator. Used, eg, on the Arduino Pro/ Pro Mini boards. 8MHz- XTAL-08895 16MHz- XTAL-08900; PROD_ID: XTAL-08900
Y2 = Crystal-ABS05-32.768KHZ-9-T:CRYSTAL: SMD LOW PROFILE CRYSTAL 1.6 x 1.0 x 0.5mm http://www.digikey.com/product-detail/en/ABS05-32.768KHZ-9-T/535-11897-1-ND/35080692; DIGIKEY: 535-11897-1-ND
Y3 = SparkFun-FreqCtrl:RESONATOR: Resonator Small SMD resonator. Used, eg, on the Arduino Pro/ Pro Mini boards. 8MHz- XTAL-08895 16MHz- XTAL-08900; DIGIKEY: 490-1195-1-ND; PROD_ID: XTAL-08895
Y4 = Crystal-Murata-XRCGB27M120F3M00R0:CRYSTAL: Murata XRCGB27M120F3M00R0 Small package (2.0x1.6mm) dgikey: http://www.digikey.com/product-detail/en/XRCGB27M120F3M00R0/490-5581-6-ND/2368409; DIGIKEY: 490-5581-6-ND

## Board
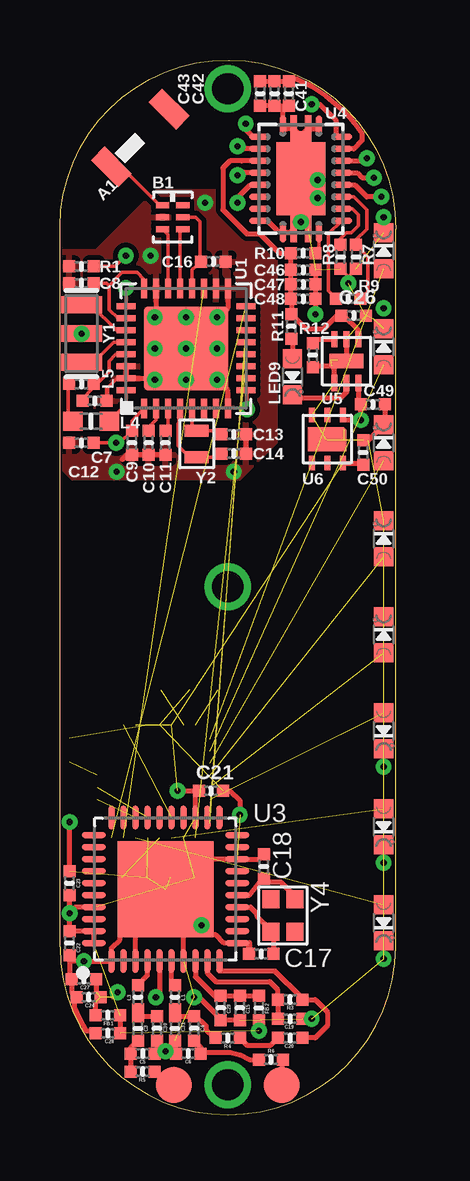
[diagram p2: board, top side]
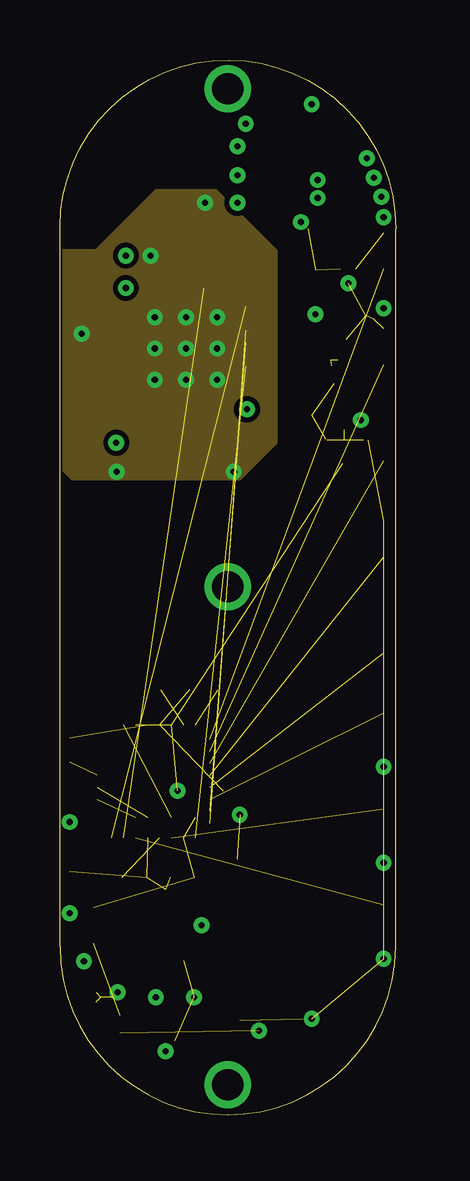
[diagram p3: board, inner layer Route2]
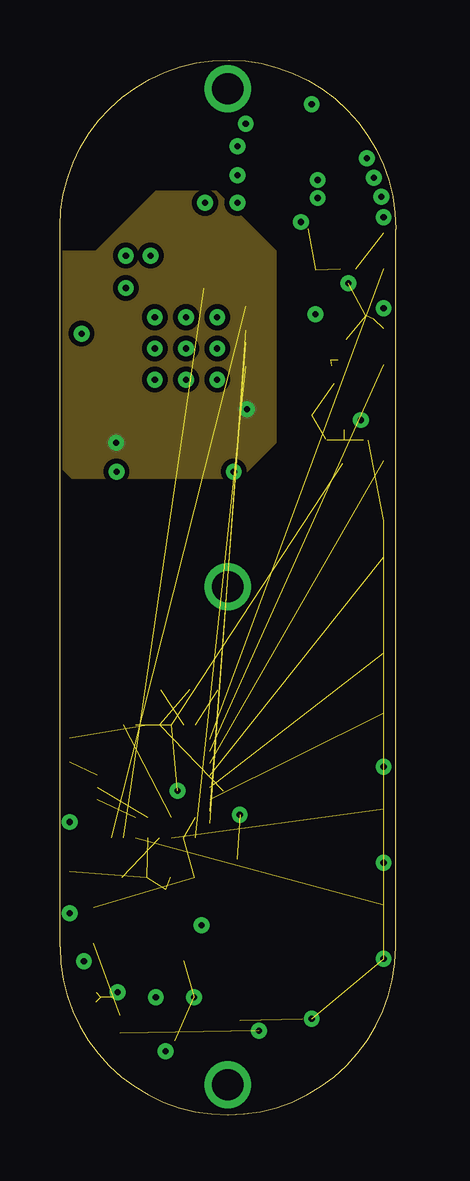
[diagram p4: board, inner layer Route15]
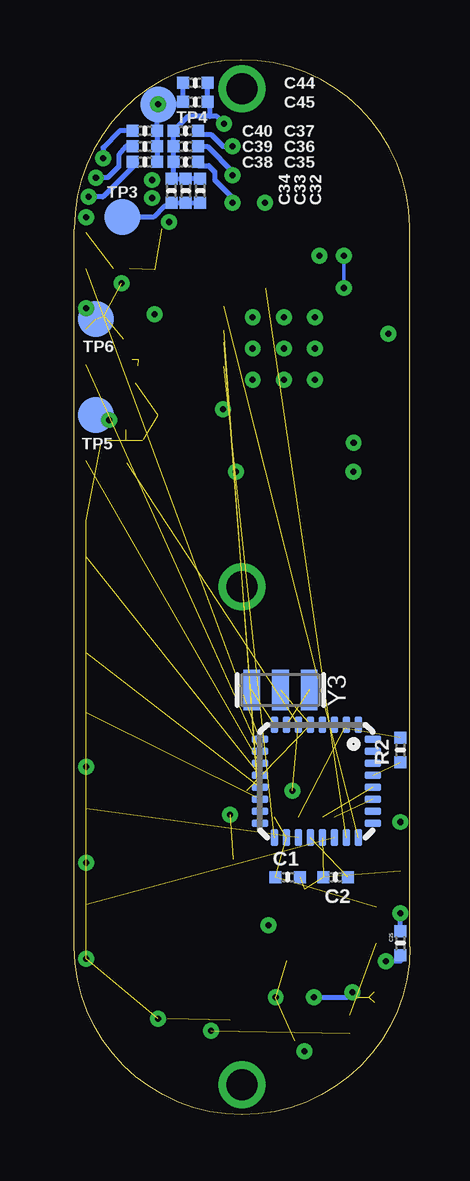
[diagram p5: board, bottom side, seen from below]

Size 14 x 43.95 mm. Coordinates in mm from the lower left corner, seen from the top.
Outline: 0,7 0,37 arc-180 14,36.9 14,7 arc-180 0,7
Copper layers (1*2*15*16): Top 0.035mm / dielectric 1.5mm / Route2 0.035mm / dielectric 0.15mm / Route15 0.035mm / dielectric 0.2mm / Bottom 0.035mm
Design rules "default *": minimum track width 10mil, minimum drill 24mil, track to track 8mil, track to pad 8mil, pad to pad 8mil, via to via 8mil, smd to smd 8mil, copper to edge 4mil, drill to drill 8mil, minimum pad ring 10mil, minimum via ring 8mil, stop-mask expansion 2mil, vias tented up to drill 0mil, thermal gap 8mil

### Footprints (pad centres in the part's own frame; a part is rotated, then mirrored left to right if it is on the bottom)
2450AT18A100 = smd 0.8 x 1.6: P$1 -1.7,0; P$2 1.7,0
2450BM14A0002T = smd 0.25 x 0.55: 1 -0.5,-0.425; 2 0,-0.425; 3 0.5,-0.425; 4 0.5,0.425; 5 0,0.425; 6 -0.5,0.425
_0402MP = smd 0.5 x 0.5: 1 -0.508,0; 2 0.508,0
_0603MP = smd 0.8 x 0.8: 1 -0.762,0; 2 0.762,0
CHIPLED_0603_NOOUTLINE = smd 0.8 x 0.8: A 0,-0.75; C 0,0.75
TESTPOINT_ROUND_1MM = smd 1.5 x 1.5: P$1 0,0
QFN32_5MM = smd 0.8 x 0.25: 1 -2.5,1.75; 2 -2.5,1.25; 3 -2.5,0.75; 4 -2.5,0.25; 5 -2.5,-0.25; 6 -2.5,-0.75; 7 -2.5,-1.25; 8 -2.5,-1.75; 17 2.5,-1.75; 18 2.5,-1.25; 19 2.5,-0.75; 20 2.5,-0.25; 21 2.5,0.25; 22 2.5,0.75; 23 2.5,1.25; 24 2.5,1.75 | smd 0.25 x 0.8: 9 -1.75,-2.5; 10 -1.25,-2.5; 11 -0.75,-2.5; 12 -0.25,-2.5; 13 0.25,-2.5; 14 0.75,-2.5; 15 1.25,-2.5; 16 1.75,-2.5; 25 1.75,2.5; 26 1.25,2.5; 27 0.75,2.5; 28 0.25,2.5; 29 -0.25,2.5; 30 -0.75,2.5; 31 -1.25,2.5; 32 -1.75,2.5 | smd 3.5 x 3.5: 33 0,0
MLF32-M1-A = smd 0.7 x 0.3: 1 -2.35,1.75; 2 -2.35,1.25; 3 -2.35,0.75; 4 -2.35,0.25; 5 -2.35,-0.25; 6 -2.35,-0.75; 7 -2.35,-1.25; 8 -2.35,-1.75; 17 2.35,-1.75; 18 2.35,-1.25; 19 2.35,-0.75; 20 2.35,-0.25; 21 2.35,0.25; 22 2.35,0.75; 23 2.35,1.25; 24 2.35,1.75 | smd 0.3 x 0.7: 9 -1.75,-2.35; 10 -1.25,-2.35; 11 -0.75,-2.35; 12 -0.25,-2.35; 13 0.25,-2.35; 14 0.75,-2.35; 15 1.25,-2.35; 16 1.75,-2.35; 25 1.75,2.35; 26 1.25,2.35; 27 0.75,2.35; 28 0.25,2.35; 29 -0.25,2.35; 30 -0.75,2.35; 31 -1.25,2.35; 32 -1.75,2.35
HVQFN40-6X6 = smd 1 x 0.25: 1 -2.99,2.25; 2 -2.99,1.75; 3 -2.99,1.25; 4 -2.99,0.75; 5 -2.99,0.25; 6 -2.99,-0.25; 7 -2.99,-0.75; 8 -2.99,-1.25; 9 -2.99,-1.75; 10 -2.99,-2.25; 21 2.99,-2.25; 22 2.99,-1.75; 23 2.99,-1.25; 24 2.99,-0.75; 25 2.99,-0.25; 26 2.99,0.25; 27 2.99,0.75; 28 2.99,1.25; 29 2.99,1.75; 30 2.99,2.25 | smd 0.25 x 1: 11 -2.25,-2.99; 12 -1.75,-2.99; 13 -1.25,-2.99; 14 -0.75,-2.99; 15 -0.25,-2.99; 16 0.25,-2.99; 17 0.75,-2.99; 18 1.25,-2.99; 19 1.75,-2.99; 20 2.25,-2.99; 31 2.25,2.99; 32 1.75,2.99; 33 1.25,2.99; 34 0.75,2.99; 35 0.25,2.99; 36 -0.25,2.99; 37 -0.75,2.99; 38 -1.25,2.99; 39 -1.75,2.99; 40 -2.25,2.99 | smd 4 x 4: TP 0,0
RHL_R-VQFN-N20 = smd 0.85 x 0.28: 1 -2.225,-0.75; 10 2.225,-0.75; 11 2.225,0.75; 20 -2.225,0.75 | smd 0.28 x 0.85: 2 -1.75,-1.725; 3 -1.25,-1.725; 4 -0.75,-1.725; 5 -0.25,-1.725; 6 0.25,-1.725; 7 0.75,-1.725; 8 1.25,-1.725; 9 1.75,-1.725; 12 1.75,1.725; 13 1.25,1.725; 14 0.75,1.725; 15 0.25,1.725; 16 -0.25,1.725; 17 -0.75,1.725; 18 -1.25,1.725; 19 -1.75,1.725 | smd 3.05 x 2.05: EXP@1 0,0 | smd 1.125 x 0.28: EXP@2 2.075,-0.3; EXP@4 2.075,0.3; EXP@5 -2.075,0.3; EXP@7 -2.075,-0.3 | smd 0.45 x 0.4: EXP@3 1.75,0; EXP@6 -1.75,0
LTC4065L = smd 0.25 x 0.675: 1 -0.5,-0.912; 2 0,-0.912; 3 0.5,-0.912; 4 0.5,0.912; 5 0,0.912; 6 -0.5,0.912 | smd 1.32 x 0.6: 7 0.05,0 | smd 0.141 x 0.141 rotated 45: 71 -0.61,-0.2 | smd 0.14 x 0.5: 72 -0.64,0.05
MCP1700 = smd 0.25 x 0.6: 1 -0.65,-1; 2 0,-1; 3 0.65,-1; 4 0.65,1; 5 0,1; 6 -0.65,1 | smd 1.5 x 1: 7 0.05,0 | smd 0.141 x 0.141 rotated 45: 71 -0.7,-0.4 | smd 0.2 x 0.9: 72 -0.7,0.05
MAKE-UB312-MICRO = drill 1.3 pad 1.6: P$1 0,0
RESONATOR-SMD = smd 0.7 x 1.7: 1 -1.2,0; 2 0,0; 3 1.2,0
CRYSTAL-2PIN = smd 0.5 x 1: 1 -0.55,0; 2 0.55,0
CRYSTAL-MURATA-XRCGB27M120F3M00R0 = smd 0.75 x 0.7: 1 -0.675,0.5; 2 0.675,0.5; 3 0.675,-0.5; 4 -0.675,-0.5

### Placement (x,y rotation side)
A1  3.35,40.7 45 top
B1  4.7,37.4 270 top
C1  5.1,9.9 0 bottom
C2  3.1,9.9 180 bottom
C3  3.25,3.6 90 top
C4  5.6,3.6 270 top
C5  3.45,2.55 0 top
C6  5.35,2.55 0 top
C7  1.45,29.75 0 top
C8  0.9,34.65 180 top
C9  3,28 270 top
C10  3.7,28 270 top
C11  4.4,28 270 top
C12  0.9,28 180 top
C13  7.25,28.35 180 top
C14  7.25,27.55 180 top
C15  7.5,4.45 270 top
C16  6.4,35.55 0 top
C17  8.4,6.7 180 top
C18  8.5,10.35 90 top
C19  9.6,4 0 top
C20  9.6,3.2 0 top
C21  6.3,13.5 0 top
C22  0.4,7.15 270 top
C23  0.4,9.65 90 top
C24  1.2,4.9 180 top
C25  0.4,7.15 270 bottom
C26  12.25,33.3 0 top
C27  1,5.65 180 top
C28  2,3.4 180 top
C29  6.7,4.45 270 top
C30  4.05,3.6 270 top
C31  4.8,3.6 90 top
C32  8.75,38.5 270 bottom
C33  9.35,38.5 270 bottom
C34  9.95,38.5 270 bottom
C35  9.35,39.7 180 bottom
C36  9.35,40.35 180 bottom
C37  9.35,41 180 bottom
C38  11.05,39.7 180 bottom
C39  11.05,40.35 180 bottom
C40  11.05,41 180 bottom
C41  9.55,42.55 90 top
C42  8.95,42.55 90 top
C43  8.35,42.55 90 top
C44  8.95,43 180 bottom
C45  8.95,42.2 180 bottom
C46  10.15,35.2 0 top
C47  10.15,34.6 0 top
C48  10.15,34 0 top
C49  13.05,29.6 0 top
C50  12.65,27.6 90 top
FB1  2,4.15 180 top
FB2  8.3,4.45 90 top
L1  4.8,4.9 90 top
L3  3.25,4.9 90 top
L4  1.3,28.9 180 top
L5  0.9,30.45 0 top
LED1  13.5,8 180 top
LED2  13.5,12 180 top
LED3  13.5,16 180 top
LED4  13.5,20 0 top
LED5  13.5,24 0 top
LED6  13.5,28 0 top
LED7  13.5,32 0 top
LED8  13.5,36 0 top
LED9  9.7,30.75 180 top
R1  0.9,35.35 180 top
R2  0.4,15.2 90 bottom
R3  9.6,4.8 180 top
R4  7,3.2 180 top
R5  3.45,1.8 180 top
R6  8.8,2.3 0 top
R7  12.03,34 180 top
R8  11.7,35.75 90 top
R9  12.35,35.75 90 top
R10  10.15,35.9 180 top
R11  9.65,32.85 270 top
R12  10.55,31.65 270 top
TP1  4.75,1.25 270 top
TP2  9.25,1.25 180 top
TP3  12,37.4 0 bottom
TP4  10.5,42.1 0 bottom
TP5  13.1,29.15 0 bottom
TP6  13.1,33.15 0 bottom
U1  5.26,31.93 90 top
U2  3.9,13.9 270 bottom
U3  4.4,9.4 90 top
U4  10.05,39 270 top
U5  11.95,31.4 0 top
U6  11.15,28.15 180 top
U$3  7,42.75 0 top
U$5  7,22 0 top
U$6  7,1.25 0 top
Y1  0.9,32.55 270 top
Y2  5.7,27.95 270 top
Y3  5.4,17.7 0 bottom
Y4  9.3,8.3 90 top

### Tracks (layer width: path | path; a pad name or v marks a point on that pad's centre or on a via)
AC  (via drill 0.25 pad 0.51)
  Top 0.152: U1.31 2.73,30.65 2.35,30.65 1.96,30.26 C7.2
  Top 0.203: C13.1 C14.1 | U1.30 U1.31 4.01,30.68 U1.33 | U1.8 7.01,30.18 U1.33 | U1.23 4.01,33.18 U1.33 | v3.96,33.23 U1.33 | C11.2 C10.2 C9.2 2.79,27.49 2.6,27.3 | 7.01,34.18 7.01,33.63 6.66,33.18
  other vias: 0.9,32.55 5.26,33.23 6.56,33.23 5.26,31.93 5.26,30.63 6.56,31.93 6.56,30.63 3.96,31.93 3.96,30.63 2.36,26.8 3.78,35.8 6.05,38 7.25,26.8
  pour Route2: 0,36 1.5,36 4,38.5 6.5,38.5 9,36 9,28 7.5,26.5 0.5,26.5 0,27
  pour Top (isolate 0.051): 0,36 1.5,36 4,38.5 6.5,38.5 9,36 9,28 7.5,26.5 0.5,26.5 0,27
AC1
  Bottom 0.203: C32.2 C33.2 C34.2 10.09,37.85 10.25,37.85 10.7,37.4 TP3.P$1
AC2  (via drill 0.25 pad 0.51)
  Top 0.203: TP4.P$1 10.85,42.1 11.5,41.45 11.5,40.75 U4.19
  Bottom 0.203: C38.1 C39.1 C40.1 10.54,42.1 TP4.P$1 9.56,42.1 C45.2 C44.2
  other vias: 10.5,42.1
ADC6  (1 unrouted)
ADC7  (1 unrouted)
AREF  (1 unrouted)
COIL_CHRG
  Top 0.203: 7.58,39.75 U4.4 7.1,39.75 6.8,39.45 6.8,37.7 7.8,36.7 8.35,36.7 9.15,35.9 R10.2 C46.1 C47.1 C48.1 R11.1 10.25,32.75 11,32.75 11.55,33.3 C26.1 11.85,33.3 12.45,32.7 U5.4
GND  (via drill 0.25 pad 0.51)  (34 unrouted)
  Top 0.152: 12.03,34.92 R8.1 | v12.03,34.65 12.03,34.92 | 12.03,34.92 R9.1
  Top 0.203: C6.1 4.8,2.66 | C28.2 1.49,3.5 1.1,3.5 0.85,3.95 0.6,4.5 0.6,5.01 C24.2 0.49,5.1 C27.2 0.4,5.74 C25.2 0.4,6.4 v1,6.4 U3.1 2.15,6.95 2.5,7.3 2.5,7.5 U3.TP | 4.05,3.25 C30.2 4.05,2.66 C5.2 4.06,2.65 v4.4,2.65 4.74,2.65 C6.1 | C31.1 4.8,2.55 C6.1 | C15.2 C29.2 6.7,4 5.8,4.9 v5.6,4.9 | v10.5,4 C19.2 | C18.2 8.29,10.65 U3.18 5.65,10.65 U3.TP | v7.5,12.5 7.5,13.1 7.1,13.5 C21.2 | U3.11 6.85,7.15 6.5,7.5 6.3,7.5 v5.9,7.9 5.8,8 5.8,8.2 5.6,8.2 U3.TP | U3.7 5.15,8.65 U3.TP | U3.3 3.15,8.15 U3.TP | C23.2 v0.4,12.2 | U4.EXP@1 10.1,39.05 10.1,40.7 U4.EXP@6 10.05,40.77 | LED8.C v13.5,37.4 | C46.2 C47.2 | C47.2 | C47.2 C48.2 10.66,33.54 v10.65,33.35 | U4.9 8.65,37.25 9.12,36.77 U4.10 9.6,36.77 U4.EXP@2 9.75,36.95 U4.EXP@3 | U4.EXP@4 10.35,36.95 U4.EXP@3 | U4.EXP@3 U4.EXP@1 | 10.05,40.77 U4.EXP@5 10.65,41.08 U4.20 | 10.05,40.77 U4.EXP@7 9.45,41.08 U4.1 9.3,42.04 | 9.3,42.04 C42.1 C43.1 | 9.3,42.04 C41.1 | U4.EXP@1 v10.75,38.95 v10.75,38.2 10.75,37.9 v10.05,37.2 | U5.5 11.95,31.45 | 11.95,31.45 U5.7 | 11.95,31.45 11.59,31.45 | R12.2 10.61,31.2 U5.71 11.45,31.09 U5.1 | C49.2 13.56,28.86 LED6.C 12.86,28.11 C50.2 | 11.14,28.11 U6.7
  Top 0.254: U3.11 7.89,7.15 C17.2
  Bottom 0.203: C25.2 0.4,6.4 v1,6.4
  other vias: 13.5,6.5 13.5,10.5 13.5,14.5 13.5,33.6
IO5  (1 unrouted)
IO6  (1 unrouted)
IO7  (1 unrouted)
IO8  (1 unrouted)
IO9  (1 unrouted)
IO10  (1 unrouted)
IRQ  (1 unrouted)
MISO  (1 unrouted)
MOSI  (1 unrouted)
N$1
  Top 0.152: U1.20 5.51,35.22 C16.1 5.85,35.59 5.85,37.2 5.65,37.4 B1.5
N$2
  Top 0.152: U1.29 2.33,31.68 2.05,31.4 2.05,30.95 1.55,30.45 L5.2 | L5.2 1.45,30.45 1.5,30.4 | C7.1 0.9,29.8 1.41,30.31 L5.2
N$3
  Top 0.152: U1.24 3.51,34.8 3.21,35.1 2.6,35.1 2.05,34.55 | 2.05,34.55 2.05,33.55 2.42,33.18 U1.26 | C8.1 1.95,34.65 2.05,34.55
N$4  (1 unrouted)
N$5
  Top 0.152: L5.1 0.35,30.39 0.35,28.99 L4.2
N$6  (1 unrouted)
N$7
  Top 0.152: U1.3 4.51,28.62 C11.1
N$8
  Top 0.152: U1.2 4,28.95 3.95,28.9 3.7,28.65 C10.1
N$9
  Top 0.152: U1.28 2.23,32.18 1.65,31.6 1.13,31.6 Y1.3
N$10
  Top 0.152: Y1.1 1.29,33.76 2.37,32.68 U1.27
N$11
  Top 0.152: L4.1 2.76,29.6 U1.32
N$12  (via drill 0.25)
  Top 0.152: U1.25 v2.75,34.45 | v2.75,35.8 2.3,35.35 R1.1
  Bottom 0.152: v2.75,35.8 v2.75,34.45
N$13
  Top 0.203: L3.2 3.65,5.81 U3.4
N$14
  Top 0.152: U1.21 5.01,36.78 B1.4
N$15
  Top 0.152: U1.22 4.51,36.66 B1.3
N$16
  Top 0.152: B1.1 4.15,37.9 2,40.05 1.85,40.05 A1.P$1
N$17
  Top 0.203: L1.2 4.65,5.56 U3.6
N$18
  Top 0.203: L3.1 C3.2 C30.1
N$19
  Top 0.203: Y4.1 8.91,7.62 C17.1 | U3.14 7.95,8.65 8.2,8.4 8.2,8.3 8.8,7.7 Y4.1 | 8.8,7.8 Y4.1
N$20
  Top 0.203: U3.15 7.9,9.15 8.35,9.7 8.36,9.7 | 8.36,9.7 9.2,9.7 9.7,9.2 Y4.3 | 8.36,9.7 C18.1
N$21
  Top 0.203: U3.9 6.15,5.9 6.5,5.55 8.75,5.55 9.09,5.21 R3.2 C19.1
N$22
  Top 0.152: U1.4 4.96,29.38 4.96,28.83 4.93,28.8 4.93,27.88 5.41,27.4 Y2.2 6.59,27.4 C14.2
N$23
  Top 0.152: U1.5 5.51,28.69 Y2.1 6.59,28.5 C13.2
N$24
  Top 0.203: U3.10 6.65,6 8.96,6 10.11,4.85 R3.1 10.65,4.8 11.15,4.3 11.15,3.7 10.65,3.2 C20.2
N$25
  Top 0.203: 7.61,3.05 R4.1 7.7,3 7.8,2.9 8.79,2.9 C20.1
N$26
  Top 0.203: L1.1 C31.2 C4.1 5.64,4.16 6.1,3.7 6.1,3.55 6.4,3.25 R4.2
N$27
  Top 0.203: R5.1 4.46,1.25 TP1.P$1
N$28
  Top 0.203: R6.2 9.25,2.24 TP2.P$1
N$29
  Top 0.203: U3.8 5.65,5.75 6.44,4.96 C29.1 C15.1 FB2.2
N$30  (via drill 0.25 pad 0.51)  (3 unrouted)
  Top 0.203: FB1.2 1.49,4.68 | C27.1 1.51,5.1 | U3.5 4.15,5.05 v4,4.9 | v2.4,5.1 2.2,4.9
  Bottom 0.203: v4,4.9 2.6,4.9 v2.4,5.1
N$31  (via drill 0.25 pad 0.51)
  Top 0.152: U4.2 8.2,40.75
  Top 0.203: v7.75,41.3 7.75,41.05 8.05,40.75 U4.2
  Bottom 0.203: C32.1 C33.1 C34.1 9.86,39.1 C35.2 C36.2 C37.2 9.26,41.6 8.35,41.6 | C44.1 C45.1 8.35,42.11 8.35,41.6 | v7.75,41.3 8.05,41.6 8.35,41.6
N$32
  Top 0.203: R11.2 9.7,32.29 LED9.A
N$33  (via drill 0.25 pad 0.51)
  Top 0.203: U4.17 12.7,39.75 v12.8,39.85
  Bottom 0.203: C40.2 12.1,41 12.8,40.3 v12.8,39.85
N$34
  Top 0.203: C43.2 C42.2 C41.2 9.69,43.15 9.9,43.15 10.5,42.85 11.1,42.45 11.75,41.9 12.25,41.35 12.6,40.9 12.6,40.6 12.25,40.25 U4.18
N$35  (via drill 0.25 pad 0.51)
  Top 0.203: U4.3 7.5,40.25 v7.4,40.35
  Bottom 0.203: C37.1 8.69,40.85 8.3,40.85 7.8,40.35 v7.4,40.35
N$36  (via drill 0.25 pad 0.51)
  Top 0.203: U4.5 7.5,39.25 v7.4,39.15
  Bottom 0.203: C36.1 8.45,40.35 7.4,39.3 v7.4,39.15
N$37  (via drill 0.25 pad 0.51)
  Top 0.203: U4.6 7.95,38.75 7.4,38.2 v7.4,38
  Bottom 0.203: C35.1 8.84,39.55 8.4,39.55 8.15,39.3 8.15,38.95 7.4,38.2 v7.4,38
N$38  (via drill 0.25 pad 0.51)
  Top 0.203: U4.16 12.4,39.25 12.6,39.05 v13.1,39.05
  Bottom 0.203: 11.55,40.3 C39.2 11.85,40.35 12.15,40 12.15,39.5 12.6,39.05 v13.1,39.05
N$39  (via drill 0.25 pad 0.51)
  Top 0.203: U4.15 12.3,38.75 12.8,38.25 v13.4,38.25
  Bottom 0.203: C38.2 11.4,39.65 12.8,38.25 v13.4,38.25
N$40
  Top 0.152: U4.14 12.25,38.25 12.8,37.7 12.8,36.91 12.35,36.46 R9.2 | R9.2 12.39,36.11 | R7.1 12.85,34.29 12.85,35.76 R9.2
N$41
  Top 0.152: U4.13 12.2,37.75 12.45,37.5 12.45,37.05 12.15,36.75 11.95,36.75 11.7,36.5 R8.2
N$42
  Top 0.152: U4.11 10.8,36.14 R10.1
N$43
  Top 0.152: U4.12 11.75,37.25 11.2,36.7 11.2,34.34 R7.2
N$44
  Top 0.203: U5.2 11.95,30.1 11.7,29.85 9.85,29.85 LED9.C
N$45
  Top 0.203: R12.1 10.7,32.31 U5.6
N$47  (via drill 0.25 pad 0.25)
  Top 0.203: U6.1 11.8,28.95 v12.55,28.95 12.55,29.51 C49.1 12.45,29.69 U5.3
  Bottom 0.203: 13.05,29.15 TP5.P$1 12.9,28.95 v12.55,28.95
RDY  (1 unrouted)
RESET  (1 unrouted)
RST  (1 unrouted)
SCK  (1 unrouted)
SCL  (1 unrouted)
SDA  (1 unrouted)
TX1_ANTENNA
  Top 0.203: R5.2 C5.1 2.94,2.78 C3.1
TX2_ANTENNA
  Top 0.203: C4.2 5.86,2.83 C6.2 5.85,2.65 5.9,2.6 7.1,2.6 7.5,2.5 7.9,2.3 R6.1
VCC  (via drill 0.25 pad 0.41)
  Top 0.152: C12.1 v2.35,28 2.49,28 C9.1 3,28.92 U1.1 | U1.9 7.8,30.14 v7.8,29.4
  pour Route15: 0,36 1.5,36 4,38.5 6.5,38.5 9,36 9,28 7.5,26.5 0.5,26.5 0,27
VDD  (via drill 0.25 pad 0.25)  (9 unrouted)
  Top 0.203: FB1.1 C28.1 | v0.4,8.4 C25.1 0.46,7.65 U3.39 U3.40 | v0.4,8.4 C23.1 | U3.37 0.65,8.65 v0.4,8.4 | U3.23 5.65,13.26 C21.1 v4.9,13.5 | v8.3,3.5 FB2.1 | U6.6 12.59,27.15 C50.1
  Bottom 0.203: C25.1 v0.4,8.4
(copper drawn outside any net)
  shapes: Top area x4